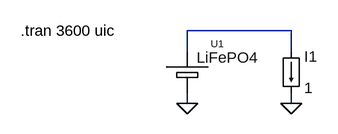
[diagram p0: schematic test1.asc]
test1.asc, the LTspice schematic file:
Version 4
SHEET 1 880 680
WIRE 336 128 176 128
WIRE 176 160 176 128
WIRE 336 160 336 128
WIRE 176 240 176 224
WIRE 336 240 336 224
FLAG 176 240 0
FLAG 336 240 0
SYMBOL load 320 160 R0
WINDOW 123 0 0 Left 0
WINDOW 39 0 0 Left 0
SYMATTR InstName I1
SYMATTR Value 1
SYMBOL battery-cell 176 192 R0
SYMATTR InstName U1
SYMATTR Value2 C=1 SOC=1 RS=1n
TEXT -80 128 Left 0 !.tran 3600 uic

The netlist it stands for:
* test1.asc
I1 N001 0 1
XU1 N001 0 LiFePO4 C=1 SOC=1 RS=1n  ; pins C A
.tran 3600 uic
.lib battery-cell.mod
.backanno
.end